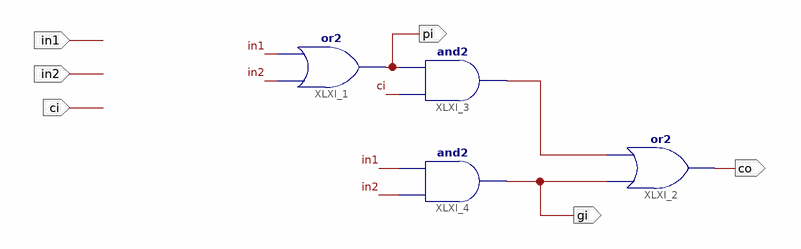
[diagram p0: schematic sheet 1]
// Xilinx ISE schematic cla1b.sch (spartan3e) as structural Verilog: 4 symbols, 6 ports
module cla1b (
  input  in1,
  input  in2,
  input  ci,
  output pi,
  output co,
  output gi
);

  wire XLXN_16;

  or XLXI_1 (pi, in2, in1);
  or XLXI_2 (co, gi, XLXN_16);
  and XLXI_3 (XLXN_16, ci, pi);
  and XLXI_4 (gi, in2, in1);
endmodule
